# EAGLE schematic Lab4 (EAGLE 9.3.0)
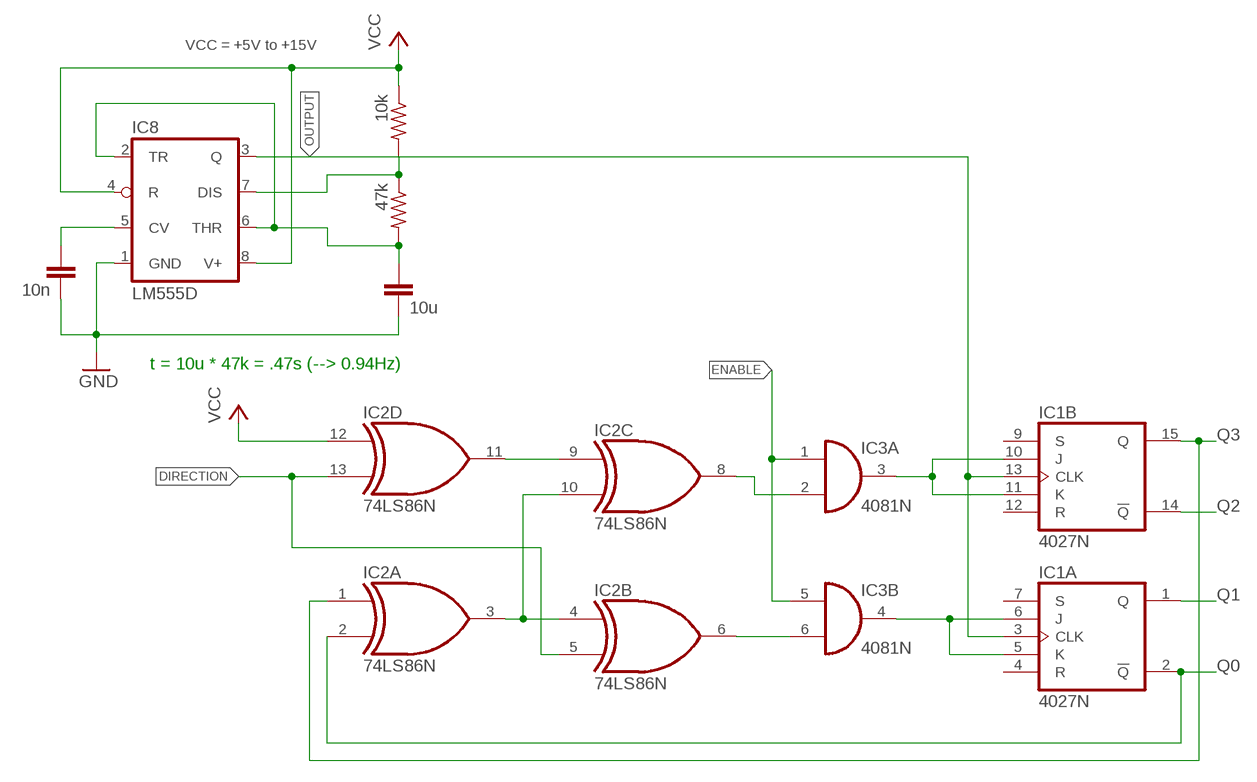
[diagram p0: schematic, sheet 1]

## Parts
C7  10u  C-EUC0805  [C0805]
C8  10n  C-EUC0805  [C0805]
IC1  4027N  [DIL16]
IC2  74LS86N  [DIL14]
IC3  4081N  [DIL14]
IC8  LM555D  [SO08]
RA3  10k  R-US_R0805  [R0805]
RB1  47k  R-US_R0805  [R0805]

## Nets
GND: C7.2 C8.2 IC8.1(GND)
N$1: IC1.10(B:J) IC1.11(B:K) IC3.3(A:O)
N$2: IC1.5(A:K) IC1.6(A:J) IC3.4(B:O)
N$3: IC2.9(C:I0) IC2.11(D:O)
N$4: IC2.3(A:O) IC2.4(B:I0) IC2.10(C:I1)
N$5: IC2.5(B:I1) IC2.13(D:I1)
N$10: IC2.8(C:O) IC3.2(A:I1)
N$11: IC2.6(B:O) IC3.6(B:I1)
N$12: IC3.1(A:I0) IC3.5(B:I0)
N$21: C8.1 IC8.5(CV)
N$22: IC8.7(DIS) RA3.2 RB1.1
N$23: C7.1 IC8.2(TR) IC8.6(THR) RB1.2
OUTPUT: IC1.3(A:CLK) IC1.13(B:CLK) IC8.3(Q)
Q0: IC1.2(A:!Q) IC2.2(A:I1)
Q1: IC1.1(A:Q)
Q2: IC1.14(B:!Q)
Q3: IC1.15(B:Q) IC2.1(A:I0)
VCC: IC2.12(D:I0) IC8.4(R) IC8.8(V+) RA3.1
Unconnected: IC1.4(A:R) IC1.7(A:S) IC1.9(B:S) IC1.12(B:R) IC3.8(C:I0) IC3.9(C:I1) IC3.10(C:O) IC3.11(D:O) IC3.12(D:I0) IC3.13(D:I1)

## Notes on the sheet
- VCC = +5V to +15V
- t = 10u * 47k = .47s (--> 0.94Hz)

## Power pins joined to a net without a drawn wire
GND: IC2.7(P:GND)
VCC: IC2.14(P:VCC)
VDD: IC1.16(P:VDD) IC3.14(P:VDD)
VSS: IC1.8(P:VSS) IC3.7(P:VSS)

## Library data of the parts
C7 C8 = rcl:C-EU: CAPACITOR, European symbol
IC1 = 40xx:4027: Dual JK FLIP FLOP
IC2 = 74xx-us:74*86: Quad 2-input EXCLUSIV-OR (XOR) gate
IC3 = 40xx:4081: Quad 2-input AND
IC8 = linear:*555: TIMER
RA3 RB1 = rcl:R-US_: RESISTOR, American symbol